# Altium schematic sheet General Schematics of Design.SchDoc
size 420 x 297 mm; SheetNumber: 2; SheetTotal: 6
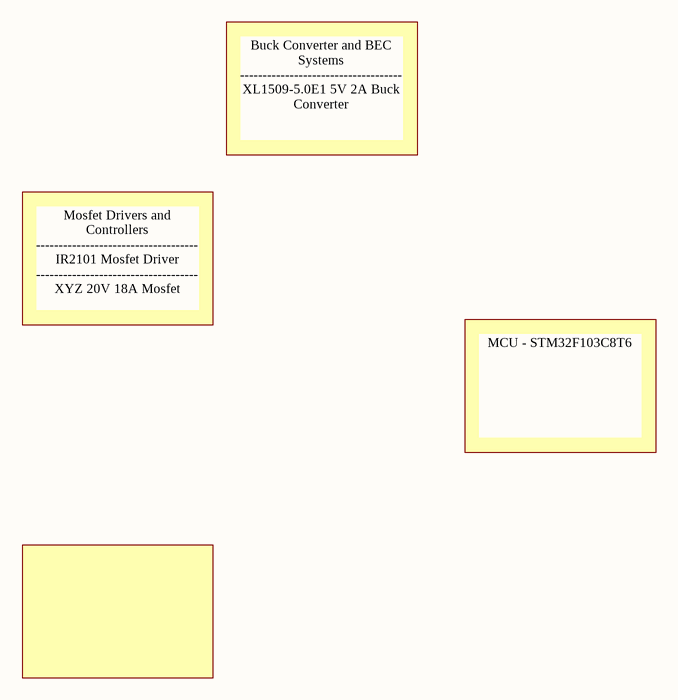
[diagram p0: General Schematics of Design.SchDoc]

## Notes on the sheet
- Buck Converter and BEC Systems ------------------------------------                                                 XL1509-5.0E1 5V 2A Buck Converter
- Mosfet Drivers and Controllers ------------------------------------    IR2101 Mosfet Driver ------------------------------------ XYZ 20V 18A Mosfet
- MCU - STM32F103C8T6
- THIS DOCUMENT AND THE DATA DISCLOSED HEREIN OR
- HEREWITH IS THE PROPERTY OF ALTIUM LIMITED AND MAY
- BE FREELY DISTRIBUTED IN WHOLE. NO RIGHTS ARE
- RESERVED OR EXPRESS OR IMPLIED WARANTEE GIVEN.
- Title :
- Size :
- Date :
- A3
- Sheet Number :
- Time :
- Revision :
- Author :
- File :